# EAGLE design nimbusrtc (EAGLE 7.7.0)
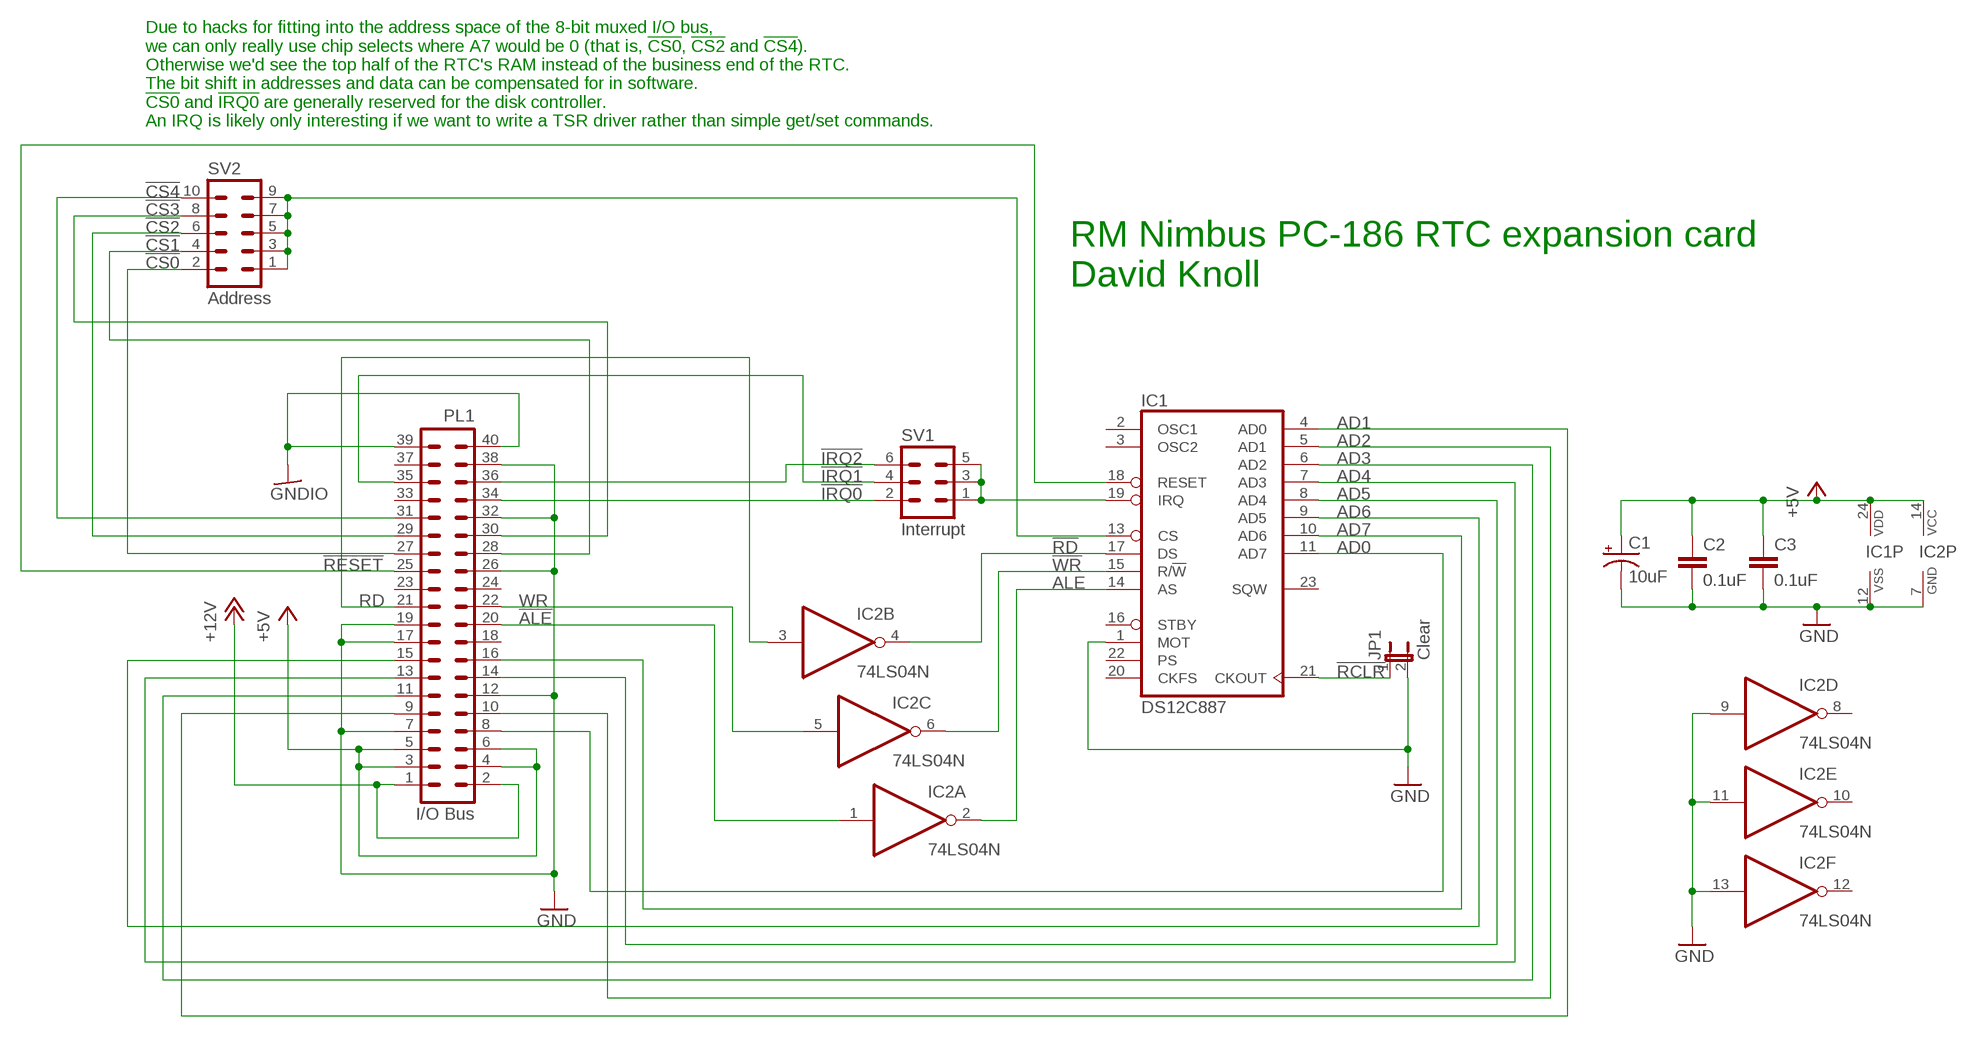
[diagram p0: schematic, sheet 1]

## Parts
C1  10uF  CPOL-USE2.5-6  [E2,5-6]
C2  0.1uF  C-EU050-024X044  [C050-024X044]
C3  0.1uF  C-EU050-024X044  [C050-024X044]
IC1  DS12C887  146818A  [DIL24]
IC2  74LS04N  [DIL14]
JP1  Clear  JP1E  [JP1]
PL1  I/O Bus  40H  [40H]
SV1  Interrupt  MA03-2  [MA03-2]
SV2  Address  MA05-2  [MA05-2]

## Nets
!ALE: IC2.1(A:I) PL1.20
!CS: IC1.13(CS) SV2.1 SV2.3 SV2.5 SV2.7 SV2.9
!CS0: PL1.27 SV2.2
!CS1: PL1.28 SV2.4
!CS2: PL1.29 SV2.6
!CS3: PL1.30 SV2.8
!CS4: PL1.31 SV2.10
!IRQ: IC1.19(IRQ) SV1.1 SV1.3 SV1.5
!IRQ0: PL1.34 SV1.2
!IRQ1: PL1.35 SV1.4
!IRQ2: PL1.36 SV1.6
!RCLR: IC1.21(CKOUT) JP1.1
!RD: IC1.17(DS) IC2.4(B:O)
!RESET: IC1.18(RESET) PL1.25
!WR: IC1.15(R/!W) IC2.6(C:O)
+5V [power]: C1.+ C2.1 C3.1 IC1.24(VDD) IC2.14(P:VCC) PL1.3 PL1.4 PL1.5 PL1.6
+12V [power]: PL1.1 PL1.2
AD0: IC1.11(AD7) PL1.8
AD1: IC1.4(AD0) PL1.9
AD2: IC1.5(AD1) PL1.10
AD3: IC1.6(AD2) PL1.11
AD4: IC1.7(AD3) PL1.13
AD5: IC1.8(AD4) PL1.14
AD6: IC1.9(AD5) PL1.15
AD7: IC1.10(AD6) PL1.16
ALE: IC1.14(AS) IC2.2(A:O)
GND [power]: C1.- C2.2 C3.2 IC1.1(MOT) IC1.12(VSS) IC2.7(P:GND) IC2.9(D:I) IC2.11(E:I) IC2.13(F:I) JP1.2 PL1.7 PL1.12 PL1.17 PL1.19 PL1.26 PL1.32 PL1.38
GNDIO [power]: PL1.39 PL1.40
RD: IC2.3(B:I) PL1.21
WR: IC2.5(C:I) PL1.22
Unconnected: IC1.2(OSC1) IC1.3(OSC2) IC1.16(STBY) IC1.20(CKFS) IC1.22(PS) IC1.23(SQW) IC2.8(D:O) IC2.10(E:O) IC2.12(F:O) PL1.18 PL1.23 PL1.24 PL1.33 PL1.37

## Notes on the sheet
- Due to hacks for fitting into the address space of the 8-bit muxed I/O bus,
  we can only really use chip selects where A7 would be 0 (that is, !CS0!, !CS2! and !CS4!).
  Otherwise we'd see the top half of the RTC's RAM instead of the business end of the RTC.
  The bit shift in addresses and data can be compensated for in software.
  !CS0! and !IRQ0! are generally reserved for the disk controller.
  An IRQ is likely only interesting if we want to write a TSR driver rather than simple get/set commands.
- RM Nimbus PC-186 RTC expansion card
  David Knoll

## Library data of the parts
C1 = rcl:CPOL-US: POLARIZED CAPACITOR, American symbol
C2 C3 = rcl:C-EU: CAPACITOR, European symbol
IC1 = micro-motorola:146818A: MICROCONTROLLER/MEMORY DEVICE; OC_FARNELL: unknown; OC_NEWARK: unknown
IC2 = 74xx-eu:74*04: Hex INVERTER
JP1 = jumper:JP1E: JUMPER
PL1 = con-harting-h:40H: CONNECTOR; OC_FARNELL: unknown; OC_NEWARK: unknown
SV1 = con-lstb:MA03-2: PIN HEADER; OC_FARNELL: unknown; OC_NEWARK: unknown
SV2 = con-lstb:MA05-2: PIN HEADER; OC_FARNELL: unknown; OC_NEWARK: unknown

## Net classes
1 power: width 0.406 mm

## Board
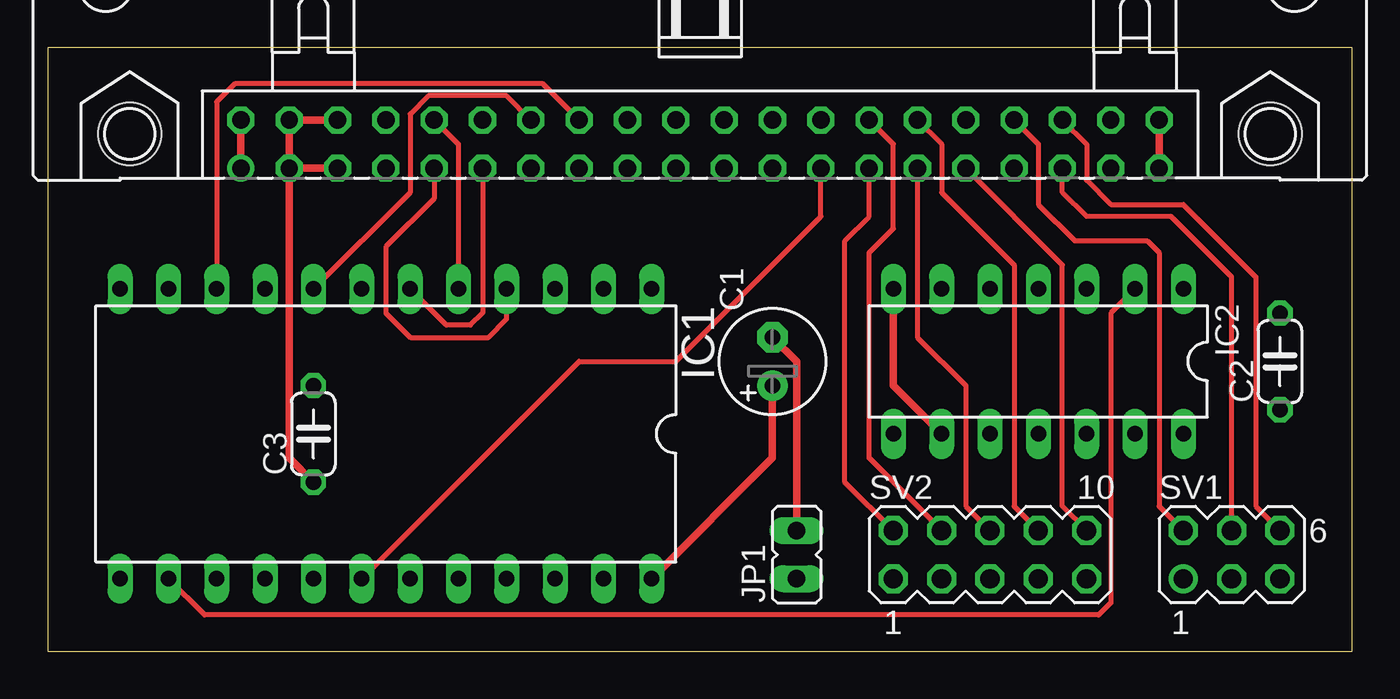
[diagram p1: board, top side]
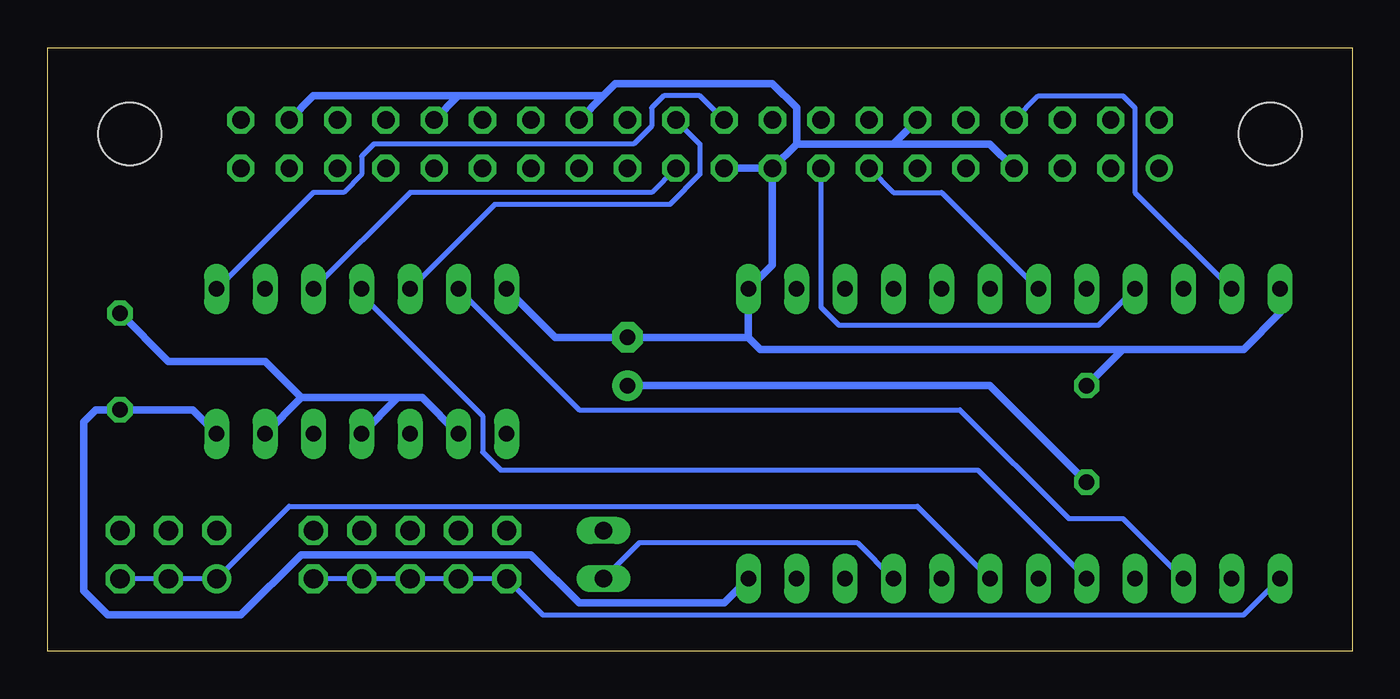
[diagram p2: board, bottom side, seen from below]

Size 68.58 x 31.75 mm. Coordinates in mm from the lower left corner, seen from the top.
Outline: 0,0 68.58,0 68.58,31.75 0,31.75 0,0
Copper layers (1*16): Top 0.035mm / dielectric 1.5mm / Bottom 0.035mm
Design rules "default": minimum track width 10mil, minimum drill 24mil, track to track 8mil, track to pad 8mil, pad to pad 8mil, via to via 8mil, smd to smd 8mil, copper to edge 40mil, drill to drill 8mil, minimum pad ring 10mil, minimum via ring 8mil, stop-mask expansion 4mil, vias tented up to drill 0mil, thermal gap 10mil

### Footprints (pad centres in the part's own frame; a part is rotated, then mirrored left to right if it is on the bottom)
E2,5-6 = drill 0.813 pad 1.6: + -1.27,0 | drill 0.813 pad 1.6 octagon: - 1.27,0
C050-024X044 = drill 0.813 octagon: 1 -2.54,0; 2 2.54,0
DIL24 = drill 0.813 long: 1 -13.97,-7.62; 2 -11.43,-7.62; 3 -8.89,-7.62; 4 -6.35,-7.62; 5 -3.81,-7.62; 6 -1.27,-7.62; 7 1.27,-7.62; 8 3.81,-7.62; 9 6.35,-7.62; 10 8.89,-7.62; 11 11.43,-7.62; 12 13.97,-7.62; 13 13.97,7.62; 14 11.43,7.62; 15 8.89,7.62; 16 6.35,7.62; 17 3.81,7.62; 18 1.27,7.62; 19 -1.27,7.62; 20 -3.81,7.62; 21 -6.35,7.62; 22 -8.89,7.62; 23 -11.43,7.62; 24 -13.97,7.62
DIL14 = drill 0.813 long: 1 -7.62,-3.81; 2 -5.08,-3.81; 3 -2.54,-3.81; 4 0,-3.81; 5 2.54,-3.81; 6 5.08,-3.81; 7 7.62,-3.81; 8 7.62,3.81; 9 5.08,3.81; 10 2.54,3.81; 11 0,3.81; 12 -2.54,3.81; 13 -5.08,3.81; 14 -7.62,3.81
JP1 = drill 0.914 long: 1 0,-1.27; 2 0,1.27
40H = drill 0.914: 1 -24.13,-1.27 | drill 0.914 octagon: 2 -24.13,1.27; 3 -21.59,-1.27; 4 -21.59,1.27; 5 -19.05,-1.27; 6 -19.05,1.27; 7 -16.51,-1.27; 8 -16.51,1.27; 9 -13.97,-1.27; 10 -13.97,1.27; 11 -11.43,-1.27; 12 -11.43,1.27; 13 -8.89,-1.27; 14 -8.89,1.27; 15 -6.35,-1.27; 16 -6.35,1.27; 17 -3.81,-1.27; 18 -3.81,1.27; 19 -1.27,-1.27; 20 -1.27,1.27; 21 1.27,-1.27; 22 1.27,1.27; 23 3.81,-1.27; 24 3.81,1.27; 25 6.35,-1.27; 26 6.35,1.27; 27 8.89,-1.27; 28 8.89,1.27; 29 11.43,-1.27; 30 11.43,1.27; 31 13.97,-1.27; 32 13.97,1.27; 33 16.51,-1.27; 34 16.51,1.27; 35 19.05,-1.27; 36 19.05,1.27; 37 21.59,-1.27; 38 21.59,1.27; 39 24.13,-1.27; 40 24.13,1.27 | hole 3.302: -29.972,0.533; 29.972,0.533
MA03-2 = drill 1.016: 1 -2.54,-1.27 | drill 1.016 octagon: 2 -2.54,1.27; 3 0,-1.27; 4 0,1.27; 5 2.54,-1.27; 6 2.54,1.27
MA05-2 = drill 1.016 octagon: 1 -5.08,-1.27; 2 -5.08,1.27; 3 -2.54,-1.27; 4 -2.54,1.27; 5 0,-1.27; 6 0,1.27; 7 2.54,-1.27; 8 2.54,1.27; 9 5.08,-1.27; 10 5.08,1.27

### Placement (x,y rotation side)
C1  38.1,15.24 90 top
C2  64.77,15.24 90 top
C3  13.97,11.43 90 top
IC1  17.78,11.43 180 top
IC2  52.07,15.24 180 top
JP1  39.37,5.08 0 top
PL1  34.29,26.67 0 top
SV1  62.23,5.08 0 top
SV2  49.53,5.08 0 top

### Tracks (layer width: path | path; a pad name or v marks a point on that pad's centre or on a via)
!ALE
  Bottom 0.254: IC2.1 54.61,24.13 53.02,24.13 52.07,25.08 52.07,26.04 51.44,26.67 37.78,26.67 36.83,27.62 36.83,28.57 36.2,29.21 34.29,29.21 PL1.20
!CS
  Bottom 0.254: IC1.13 5.71,1.91 42.55,1.91 SV2.1 SV2.3 SV2.5 SV2.7 SV2.9
!CS0
  Top 0.254: PL1.27 43.18,22.86 41.91,21.59 41.91,8.89 SV2.2
!CS1
  Top 0.254: SV2.4 43.18,10.16 43.18,20.95 44.45,22.23 44.45,26.67 PL1.28
!CS2
  Top 0.254: PL1.29 45.72,16.51 48.26,13.97 48.26,7.62 SV2.6
!CS3
  Top 0.254: PL1.30 46.99,26.67 46.99,24.13 50.8,20.32 50.8,7.62 SV2.8
!CS4
  Top 0.254: SV2.10 53.34,7.62 53.34,20.32 PL1.31
!IRQ
  Bottom 0.254: IC1.19 22.86,7.62 55.88,7.62 SV1.1 SV1.3 SV1.5
!IRQ0
  Top 0.254: PL1.34 52.07,26.67 52.07,23.5 53.98,21.59 57.78,21.59 58.42,20.95 58.42,7.62 SV1.2
!IRQ1
  Top 0.254: PL1.35 53.34,24.13 54.61,22.86 59.05,22.86 62.23,19.68 SV1.4
!IRQ2
  Top 0.254: PL1.36 54.61,26.67 54.61,24.77 55.88,23.5 59.69,23.5 63.5,19.68 63.5,7.62 SV1.6
!RCLR
  Bottom 0.254: IC1.21 26.04,5.71 37.47,5.71 JP1.1
!RD
  Bottom 0.254: IC1.17 19.68,9.53 44.77,9.53 45.72,10.48 45.72,12.38 52.07,18.73 IC2.4
!RESET
  Top 0.254: IC1.18 27.94,15.24 33.02,15.24 40.64,22.86 PL1.25
!WR
  Bottom 0.254: IC1.15 12.06,6.99 14.92,6.99 20.64,12.7 40.64,12.7 IC2.6
+5V
  Top 0.406: PL1.6 PL1.4 PL1.3 | C3.1 12.7,10.16 PL1.3 | PL1.3 PL1.5 | IC1.24 38.1,10.16 C1.+
  Bottom 0.406: IC2.14 60.96,12.7 C2.1 66.04,12.7 66.67,12.06 66.67,3.17 65.41,1.91 58.42,1.91 55.24,5.08 43.18,5.08 40.64,2.54 33.02,2.54 IC1.24 | C3.1 19.05,13.97 C1.+
+12V
  Top 0.406: PL1.2 PL1.1
AD0
  Bottom 0.254: IC1.11 11.43,24.13 11.43,28.57 12.06,29.21 16.51,29.21 PL1.8
AD1
  Top 0.254: IC1.4 24.13,17.46 23.18,16.51 19.05,16.51 17.78,17.78 17.78,21.27 20.32,23.81 PL1.9
AD2
  Top 0.254: IC1.5 21.59,26.67 PL1.10
AD3
  Top 0.254: IC1.6 20.95,17.14 22.23,17.14 22.86,17.78 PL1.11
AD4
  Bottom 0.254: IC1.7 21.59,24.13 24.13,24.13 PL1.13
AD5
  Top 0.254: IC1.8 19.05,24.13 19.05,28.26 20,29.21 24.13,29.21 PL1.14
AD6
  Bottom 0.254: IC1.9 13.34,17.14 26.99,17.14 27.94,18.1 PL1.15
AD7
  Top 0.254: IC1.10 8.89,28.89 9.84,29.84 26.04,29.84 PL1.16
ALE
  Top 0.254: IC1.14 8.26,1.91 55.24,1.91 55.88,2.54 55.88,17.78 IC2.2
GND
  Top 0.406: IC2.9 44.45,13.97 IC2.7 | JP1.2 39.37,15.24 C1.-
  Bottom 0.406: IC2.7 41.91,16.51 C1.- 31.75,16.51 | 50.16,13.34 IC2.11 | 50.16,13.34 48.9,13.34 IC2.9 | 55.24,13.34 IC2.13 | 50.16,13.34 55.24,13.34 | PL1.32 46.99,29.21 | PL1.38 54.61,29.21 46.99,29.21 | PL1.7 19.05,26.67 24.13,26.67 | PL1.17 30.48,20.32 IC1.1 31.75,16.51 | PL1.17 PL1.19 | 24.13,26.67 PL1.12 | 29.21,26.67 24.13,26.67 | PL1.17 29.21,26.67 | 12.06,15.88 C3.2 | IC1.12 3.81,17.78 5.71,15.88 12.06,15.88 | 55.24,13.34 57.15,15.24 62.23,15.24 C2.2 | 29.21,26.67 29.21,28.57 30.48,29.84 38.73,29.84 39.37,29.21 | 46.99,29.21 39.37,29.21 | 39.37,29.21 PL1.26 | 12.06,15.88 31.11,15.88 31.75,16.51
GNDIO
  Top 0.406: PL1.40 PL1.39
RD
  Bottom 0.254: IC2.3 49.53,24.13 36.83,24.13 PL1.21
WR
  Bottom 0.254: IC2.5 45.09,23.5 35.88,23.5 34.29,25.08 34.29,26.67 PL1.22